# EAGLE design zigduino-v6d (EAGLE 6.3)
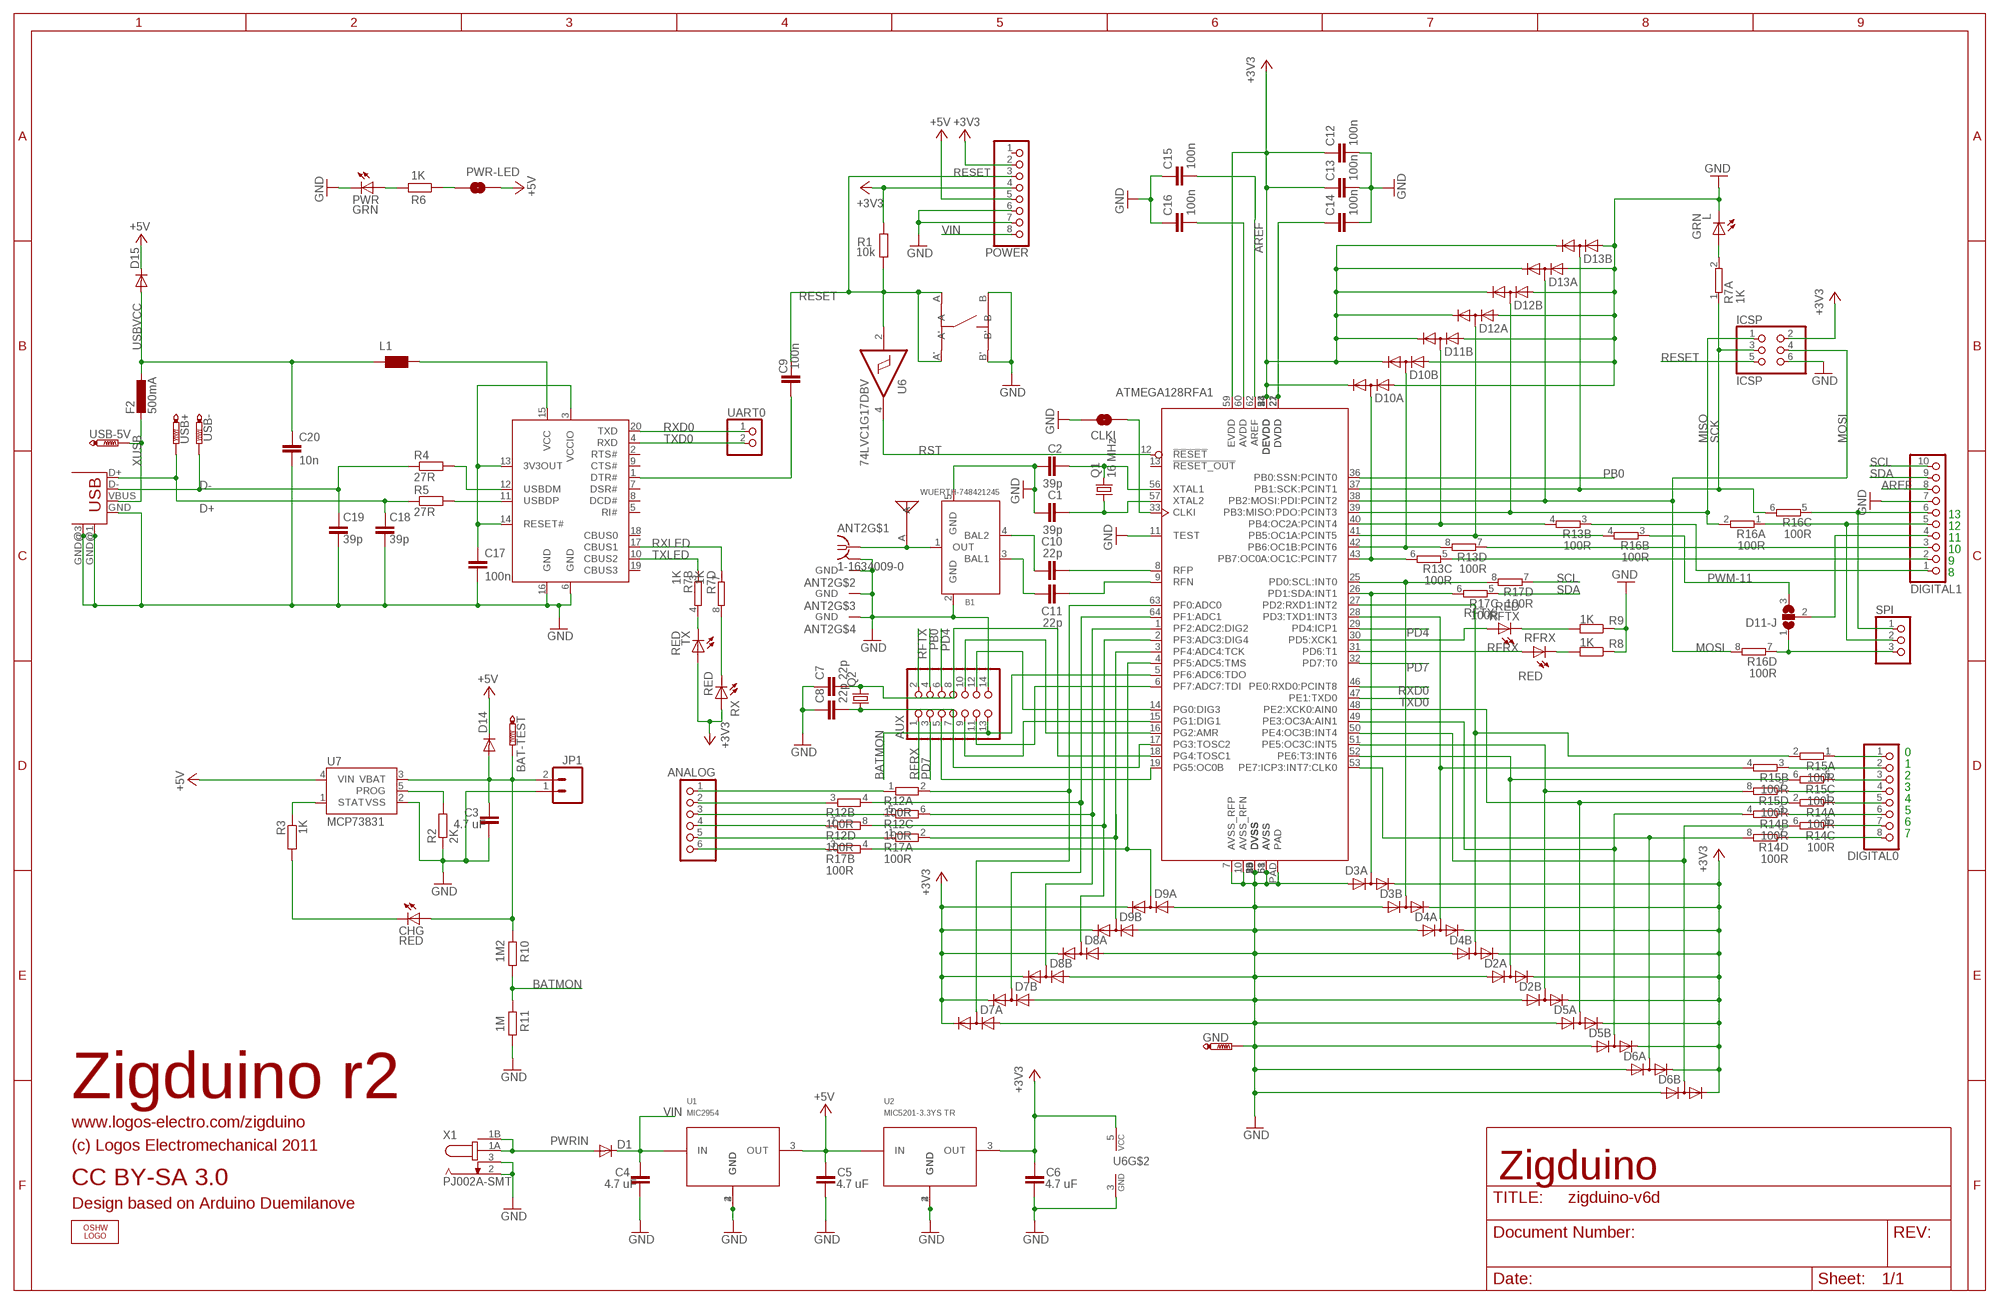
[diagram p0: schematic, sheet 1]

## Parts
ANALOG  PINHD-1X6  [1X06]
ANT1  MOLEX-ANT  [MOLEX-ANT]
ANT2  1-1634009-0  [MMCX-THRU]
AUX  PINHD-2X7_2.00  [2X07M]
B1  WUERTH-748421245  [WURTH-BALUN]
BAT-TEST  PTR1TP13SQ  [TP13SQ]
C1  39p  C-EUC0603  [C0603]
C2  39p  C-EUC0603  [C0603]
C3  4.7 uF  C-EUC1206  [C1206]
C4  4.7 uF  C-EUC1206  [C1206]
C5  4.7 uF  C-EUC1206  [C1206]
C6  4.7 uF  C-EUC1206  [C1206]
C7  22p  C-EUC0603  [C0603]
C8  22p  C-EUC0603  [C0603]
C9  100n  C-EUC0603  [C0603]
C10  22p  C-EUC0603  [C0603]
C11  22p  C-EUC0603  [C0603]
C12  100n  C-EUC0603  [C0603]
C13  100n  C-EUC0603  [C0603]
C14  100n  C-EUC0603  [C0603]
C15  100n  C-EUC0603  [C0603]
C16  100n  C-EUC0603  [C0603]
C17  100n  C-EUC0603  [C0603]
C18  39p  C-EUC0603  [C0603]
C19  39p  C-EUC0603  [C0603]
C20  10n  C-EUC0603  [C0603]
CHG  RED  LEDCHIP-LED0603  [CHIP-LED0603]
CLKI  SOLDERJUMPERTRACE  [SJ_2S-TRACE]
D1  DIODE-SMB  [SMB]
D2  SD103ASDM  [SOT26]
D3  SD103ASDM  [SOT26]
D4  SD103ASDM  [SOT26]
D5  SD103ASDM  [SOT26]
D6  SD103ASDM  [SOT26]
D7  SD103ASDM  [SOT26]
D8  SD103ASDM  [SOT26]
D9  SD103ASDM  [SOT26]
D10  SD103ASDM  [SOT26]
D11  SD103ASDM  [SOT26]
D11-J  SJ2W  [SJ_2]
D12  SD103ASDM  [SOT26]
D13  SD103ASDM  [SOT26]
D14  DIODE-SMB  [SMB]
D15  DIODE-SMB  [SMB]
DIGITAL0  PINHD-1X8  [1X08]
DIGITAL1  PINHD-1X10  [1X10]
F2  500mA  L-EUL1812  [L1812]
GND  PTR1TP13SQ  [TP13SQ]
ICSP  ICSP  PINHD-2X3  [2X03]
JP1  M02-JST-2MM-SMT  [S2B-PH]
L  GRN  LEDCHIP-LED0603  [CHIP-LED0603]
L1  WE-CBF_0805  [0805]
LOGO1  OSHW_LOGO_FILLX0200-NT  [OSHW_FILLX200_NOTEXT]
POWER  PINHD-1X8  [1X08]
PWR  GRN  LEDCHIP-LED0603  [CHIP-LED0603]
PWR-LED  SOLDERJUMPERTRACE  [SJ_2S-TRACE]
Q1  16 MHz  CRYSTALCSM-3X  [CSM-3X]
Q2  CRYSTALTC26H  [TC26H]
R1  10k  R-EU_R0603  [R0603]
R2  2K  R-EU_R0603  [R0603]
R3  1K  R-EU_R0603  [R0603]
R4  27R  R-EU_R0603  [R0603]
R5  27R  R-EU_R0603  [R0603]
R6  1K  R-EU_R0603  [R0603]
R7  1K  4R-NCTS742C083  [CTS742C083-RES]
R8  1K  R-EU_R0603  [R0603]
R9  1K  R-EU_R0603  [R0603]
R10  1M2  R-EU_R0603  [R0603]
R11  1M  R-EU_R0603  [R0603]
R12  100R  4R-NCTS742C083  [CTS742C083-RES]
R13  100R  4R-NCTS742C083  [CTS742C083-RES]
R14  100R  4R-NCTS742C083  [CTS742C083-RES]
R15  100R  4R-NCTS742C083  [CTS742C083-RES]
R16  100R  4R-NCTS742C083  [CTS742C083-RES]
R17  100R  4R-NCTS742C083  [CTS742C083-RES]
RFRX  RED  LEDCHIP-LED0603  [CHIP-LED0603]
RFTX  RED  LEDCHIP-LED0603  [CHIP-LED0603]
RX  RED  LEDCHIP-LED0603  [CHIP-LED0603]
SPI  PINHD-1X3  [1X03]
SW1  EVQ-PSD02K  [EVQPSD02K]
TX  RED  LEDCHIP-LED0603  [CHIP-LED0603]
U1  MIC2954  [SOT223]
U2  MIC5201-3.3YS TR  MIC5201-3.3BS  [SOT223]
U3  ATMEGA128RFA1  [QFN64]
U4  FT231XS-R  [SSOP20]
U6  74LVC1G17DBV  [SOT23-5]
U7  MCP73831  [SOT23-5]
UART0  PINHD-1X2  [1X02]
USB  USB-MB-S  [USB-MB-S]
USB+  PTR1TP13SQ  [TP13SQ]
USB-  PTR1TP13SQ  [TP13SQ]
USB-5V  PTR1TP13SQ  [TP13SQ]
X1  PJ002A-SMT  [PJ002A-SMT]

## Nets
+3V3: C6.1 C12.1 C13.1 D2.2(A:C) D2.5(B:C) D3.2(A:C) D3.5(B:C) D4.2(A:C) D4.5(B:C) D5.2(A:C) D5.5(B:C) D6.2(A:C) D6.5(B:C) D7.2(A:C) D7.5(B:C) D8.2(A:C) D8.5(B:C) D9.2(A:C) D9.5(B:C) D10.2(A:C) D10.5(B:C) D11.5(B:C) D12.2(A:C) D12.5(B:C) D13.2(A:C) D13.5(B:C) ICSP.2 POWER.2 POWER.4 R1.2 RX.A TX.A U2.3(OUT) U3.23(DEVDD) U3.34(DEVDD) U3.44(DEVDD) U3.54(DEVDD) U3.59(EVDD) U6.5(VCC)
+5V [usbvcc]: C5.1 D14.C D15.C POWER.5 PWR-LED.2 U1.3(OUT) U2.1(IN) U7.4(VIN)
AREF [aref]: C15.2 DIGITAL1.8 U3.62(AREF)
BATMON: AUX.13 R10.2 R11.1 U3.5(PF6:ADC6:TDO)
D+: C18.1 R5.1 USB+.TP USB.D+
D-: C19.1 R4.1 USB-.TP USB.D-
DTR: C9.1 U4.1(DTR#)
GND [gnd]: ANT2.G@0(GND) ANT2.G@1(GND) ANT2.G@2(GND) ANT2.G@3(GND) AUX.14 B1.2(GND) B1.5(GND) C1.1 C2.1 C3.2 C4.2 C5.2 C6.2 C7.1 C8.1 C12.2 C13.2 C14.2 C15.1 C16.1 C17.2 C18.2 C19.2 C20.2 CLKI.2 D2.3(A:A) D2.6(B:A) D3.3(A:A) D3.6(B:A) D4.3(A:A) D4.6(B:A) D5.3(A:A) D5.6(B:A) D6.3(A:A) D6.6(B:A) D7.3(A:A) D7.6(B:A) D8.3(A:A) D8.6(B:A) D9.3(A:A) D9.6(B:A) D10.3(A:A) D10.6(B:A) D11.6(B:A) D12.3(A:A) D12.6(B:A) D13.3(A:A) D13.6(B:A) DIGITAL1.7 GND.TP ICSP.6 JP1.1 L.C POWER.6 POWER.7 PWR.C R2.1 R8.1 R9.1 R11.2 SW1.B SW1.B' U1.2(GND) U1.4(GND) U2.2(GND) U2.4(GND) U3.7(AVSS_RFP) U3.10(AVSS_RFN) U3.11(TEST) U3.20(DVSS) U3.24(DVSS) U3.35(DVSS) U3.45(DVSS) U3.55(DVSS) U3.58(AVSS) U3.61(AVSS) U3.PAD U4.6(GND) U4.16(GND) U6.3(GND) U7.2(VSS) USB.GND USB.GND@1(GND) USB.GND@3(GND) X1.2 X1.3
MISO: D12.1(B:AC) ICSP.1 R16.2 U3.39(PB3:MISO:PDO:PCINT3)
MOSI: D13.4(A:AC) ICSP.4 R16.8 U3.38(PB2:MOSI:PDI:PCINT2)
MOSI-PIN: D11-J.1 R16.7 SPI.3
N$1: R9.2 RFTX.C
N$2: L.A R7.2
N$3: PWR.A R6.2
N$4 [rf]: B1.4(BAL2) C10.1
N$5: DIGITAL0.3 R15.5
N$6: C1.2 Q1.1 U3.57(XTAL2)
N$7: C2.2 Q1.2 U3.56(XTAL1)
N$8: PWR-LED.1 R6.1
N$9 [rf]: B1.3(BAL1) C11.1
N$10: DIGITAL1.5 R16.1 SPI.2
N$11: DIGITAL0.5 R14.1
N$12: DIGITAL0.7 R14.5
N$13: DIGITAL0.6 R14.3
N$14: DIGITAL0.4 R15.7
N$15: DIGITAL0.8 R14.7
N$16: D3.1(B:AC) R17.8 U3.25(PD0:SCL:INT0)
N$17: D3.4(A:AC) R17.6 U3.26(PD1:SDA:INT1)
N$18 [gnd]: ANT1.A ANT2.C B1.1(OUT)
N$19: D12.4(A:AC) R16.4 U3.41(PB5:OC1A:PCINT5)
N$20: R8.2 RFRX.C
N$21: D2.4(A:AC) R15.6 U3.52(PE6:T3:INT6)
N$22: D2.1(B:AC) R15.8 U3.51(PE5:OC3C:INT5)
N$23 [rf]: C10.2 U3.8(RFP)
N$24 [rf]: C11.2 U3.9(RFN)
N$25: DIGITAL1.6 R16.5 SPI.1
N$26: R2.2 U7.5(PROG)
N$27: R3.1 U7.1(STAT)
N$28: R7.4 TX.C
N$29: CHG.C R3.2
N$30: C17.1 U4.3(VCCIO) U4.13(3V3OUT) U4.14(RESET#)
N$31: R7.8 RX.C
N$33: D11.1(B:AC) R13.4 U3.40(PB4:OC2A:PCINT4)
N$34 [gnd]: CLKI.1 U3.33(CLKI)
N$35: R4.2 U4.12(USBDM)
N$36: R5.2 U4.11(USBDP)
N$37: L1.2 U4.15(VCC)
N$38: D10.1(B:AC) R13.8 U3.42(PB6:OC1B:PCINT6)
N$39: D10.4(A:AC) R13.6 U3.43(PB7:OC0A:OC1C:PCINT7)
N$40: D5.4(A:AC) R14.2 U3.48(PE2:XCK0:AIN0)
N$41: D6.1(B:AC) R14.6 U3.50(PE4:OC3B:INT4)
N$42: D5.1(B:AC) R14.4 U3.49(PE3:OC3A:AIN1)
N$43: D6.4(A:AC) R14.8 U3.53(PE7:ICP3:INT7:CLK0)
N$44: ANALOG.5 R17.1
N$45: ANALOG.6 R17.3
N$47: AUX.11 U3.6(PF7:ADC7:TDI)
N$48: D7.4(A:AC) R12.2 U3.63(PF0:ADC0)
N$49: D7.1(B:AC) R12.4 U3.64(PF1:ADC1)
N$50: D8.1(B:AC) R12.6 U3.1(PF2:ADC2:DIG2)
N$51: D8.4(A:AC) R12.8 U3.2(PF3:ADC3:DIG4)
N$52: D9.1(B:AC) R17.2 U3.3(PF4:ADC4:TCK)
N$53: D9.4(A:AC) R17.4 U3.4(PF5:ADC5:TMS)
N$54: ANALOG.1 R12.1
N$55: ANALOG.2 R12.3
N$56: ANALOG.3 R12.5
N$57: ANALOG.4 R12.7
N$60: DIGITAL1.1 R13.3
N$61: D11-J.2 DIGITAL1.4
N$62: AUX.12 U3.14(PG0:DIG3)
N$63: C14.1 U3.21(DVDD) U3.22(DVDD)
N$64: C16.2 U3.60(AVDD)
N$65: DIGITAL1.2 R13.5
N$68: DIGITAL0.1 R15.1
N$69: DIGITAL0.2 R15.3
N$70: AUX.9 U3.15(PG1:DIG1)
N$71: AUX.5 U3.19(PG5:OC0B)
N$72: AUX.8 C7.2 Q2.2 U3.18(PG4:TOSC1)
N$73: AUX.7 C8.2 Q2.1 U3.17(PG3:TOSC2)
N$74: AUX.10 U3.16(PG2:AMR)
PB0: AUX.4 U3.36(PB0:SSN:PCINT0)
PD4: AUX.6 U3.29(PD4:ICP1)
PD7: AUX.3 U3.32(PD7:T0)
PWM-10: DIGITAL1.3 R13.7
PWM-11: D11-J.3 R16.3
PWRIN [power]: D1.A X1.1A X1.1B
RESET: C9.2 ICSP.5 POWER.3 R1.1 SW1.A SW1.A' U6.2(I)
RFRX: AUX.1 RFRX.A U3.31(PD6:T1)
RFTX: AUX.2 RFTX.A U3.30(PD5:XCK1)
RST: U3.12(!RESET!) U6.4(O)
RXD0: U3.46(PE0:RXD0:PCINT8) U4.20(TXD) UART0.1
RXD1: D4.1(B:AC) R15.2 U3.27(PD2:RXD1:INT2)
RXLED: R7.7 U4.17(CBUS1)
SCK: D13.1(B:AC) ICSP.3 R7.1 R16.6 U3.37(PB1:SCK:PCINT1)
SCL: DIGITAL1.10 R17.7
SDA: DIGITAL1.9 R17.5
TXD0: U3.47(PE1:TXD0) U4.4(RXD) UART0.2
TXD1: D4.4(A:AC) R15.4 U3.28(PD3:TXD1:INT3)
TXLED: R7.3 U4.10(CBUS2)
USBVCC [usbvcc]: C20.1 D15.A F2.1 L1.1
VBAT: BAT-TEST.TP C3.1 CHG.A D14.A JP1.2 R10.1 U7.3(VBAT)
VIN [power]: C4.1 D1.C POWER.8 U1.1(IN)
XUSB: F2.2 USB-5V.TP USB.VBUS
Unconnected: D11.2(A:C) D11.3(A:A) D11.4(A:AC) POWER.1 R7.5 R7.6 R13.1 R13.2 U3.13(!RESET_OUT!) U4.2(RTS#) U4.5(RI#) U4.7(DSR#) U4.8(DCD#) U4.9(CTS#) U4.18(CBUS0) U4.19(CBUS3)

## Notes on the sheet
- ATMEGA128RFA1
- 13
- 12
- 11
- 10
- 9
- 8
- 0
- 1
- 2
- 3
- 4
- 5
- 6
- 7
- Zigduino r2
- www.logos-electro.com/zigduino
- (c) Logos Electromechanical 2011
- CC BY-SA 3.0 | Zigduino
- Design based on Arduino Duemilanove

## Library data of the parts
ANALOG = pinhead:PINHD-1X6: PIN HEADER; BOM: INCLUDE; DNP: T; PARTNO: 19742
ANT1 = atmega128rfa1:MOLEX-ANT; BOM: INCLUDE; PARTNO: 0479480001
ANT2 = atmega128rfa1:1-1634009-0: Thru-hole MMCX connector TE Connectivity; BOM: EXCLUDE; DNP: T
AUX = pinhead-1:PINHD-2X7: PIN HEADER; DNP: T; PARTNO: 00217
B1 = atmega128rfa1:WUERTH-748421245: Recommended Balun for Atmega128RFA1; BOM: INCLUDE; PARTNO: 748421245
BAT-TEST GND USB+ USB- USB-5V = testpad:PTR1: TEST PIN; BOM: EXCLUDE; DNP: T; PARTNO: TP13
C1 C2 C18 C19 = resistor:C-EU: CAPACITOR, European symbol; PARTNO: C1608C0G1H390J
C3-C6 = resistor:C-EU: CAPACITOR, European symbol; PARTNO: C3216Y5V1H475Z; VOLT: 50V
C7 C8 = resistor:C-EU: CAPACITOR, European symbol; BOM: EXCLUDE; DNP: T; PARTNO: GQM1885C1H220JB01D
C9 C12-C17 = resistor:C-EU: CAPACITOR, European symbol; PARTNO: CC0603MRY5V9BB104
C10 C11 = resistor:C-EU: CAPACITOR, European symbol; PARTNO: GQM1885C1H220JB01D
C20 = resistor:C-EU: CAPACITOR, European symbol; PARTNO: GRM188R71H103KA01D
CHG = led:LED: LED OSRAM: - CHIPLED LG R971, LG N971, LY N971, LG Q971, LY Q971, LO R971, LY R971 LH N974, LH R974 LS Q976, LO Q976, LY Q976 LO Q996 - Hyper CHIPLED LW Q18S LB Q993, LB Q99A, LB R99A - SideLED LS A670, LO A670, LY A670, LG A670, LP A670 LB A673, LV A673, LT A673, LW A673 LH A674 LY A675 LS A676, LA A676, LO A676, LY A676, LW A676 LS A679, LY A679, LG A679 - Hyper Micro SIDELED® LS Y876, LA Y876, LO Y876, LY Y876 LT Y87S - SmartLED LW L88C, LW L88S LB L89C, LB L89S, LG L890 LS L89K, LO L89K, LY L89K LS L896, LA L896, LO L896, LY L896 - TOPLED LS T670, LO T670, LY T670, LG T670, LP T670 LSG T670, LSP T670, LSY T670, LOP T670, LYG T670 LG T671, LOG T671, LSG T671 LB T673, LV T673, LT T673, LW T673 LH T674 LS T676, LA T676, LO T676, LY T676, LB T676, LH T676, LSB T676, LW T676 LB T67C, LV T67C, LT T67C, LS T67K, LO T67K, LY T67K, LW E67C LS E67B, LA E67B, LO E67B, LY E67B, LB E67C, LV E67C, LT E67C LW T67C LS T679, LY T679, LG T679 LS T770, LO T770, LY T770, LG T770, LP T770 LB T773, LV T773, LT T773, LW T773 LH T774 LS E675, LA E675, LY E675, LS T675 LS T776, LA T776, LO T776, LY T776, LB T776 LHGB T686 LT T68C, LB T68C - Hyper Mini TOPLED® LB M676 - Mini TOPLED Santana® LG M470 LS M47K, LO M47K, LY M47K Source: http://www.osram.convergy.de LUXEON: - LUMILED® LXK2-PW12-R00, LXK2-PW12-S00, LXK2-PW14-U00, LXK2-PW14-V00 LXK2-PM12-R00, LXK2-PM12-S00, LXK2-PM14-U00 LXK2-PE12-Q00, LXK2-PE12-R00, LXK2-PE12-S00, LXK2-PE14-T00, LXK2-PE14-U00 LXK2-PB12-K00, LXK2-PB12-L00, LXK2-PB12-M00, LXK2-PB14-N00, LXK2-PB14-P00, LXK2-PB14-Q00 LXK2-PR12-L00, LXK2-PR12-M00, LXK2-PR14-Q00, LXK2-PR14-R00 LXK2-PD12-Q00, LXK2-PD12-R00, LXK2-PD12-S00 LXK2-PH12-R00, LXK2-PH12-S00 LXK2-PL12-P00, LXK2-PL12-Q00, LXK2-PL12-R00 Source: www.luxeon.com KINGBRIGHT: KA-3528ASYC Source: www.kingbright.com; PARTNO: LTST-C193KRKT-5A
CLKI PWR-LED = SparkFun:SOLDERJUMPER: Solder Jumper Standard SMD solder jumper. Used to automate production. Two varients : Normally Open and Normally Closed are the same, but have different paste layers. NC will have a large amount of paste and should jumper during reflow.; BOM: EXCLUDE
D1 D14 D15 = diode:DIODE-: DIODE; PARTNO: B150B-13-F
D2-D13 = logos-diodes:SD103ASDM: Digikey SD103ASDM-FDICT-ND; BOM: INCLUDE; PARTNO: SD103ASDM-7; VOLT: 40V
D11-J = jumper:SJ2W: SMD solder JUMPER; BOM: EXCLUDE; DNP: T; PARTNO: SJ3
DIGITAL0 POWER = pinhead:PINHD-1X8: PIN HEADER; BOM: INCLUDE; DNP: T; PARTNO: 19743
DIGITAL1 = pinhead:PINHD-1X10: PIN HEADER; DNP: T; PARTNO: 20083
F2 = rcl:L-EU: INDUCTOR, European symbol; PARTNO: MF-MSMF050-2
ICSP = pinhead:PINHD-2X3: PIN HEADER; BOM: INCLUDE; DNP: T; PARTNO: 961206-6404-AR
JP1 = SparkFun:M02: Header 2 Standard 2-pin 0.1" header. Use with straight break away headers (SKU : PRT-00116), right angle break away headers (PRT-00553), swiss pins (PRT-00743), machine pins (PRT-00117), and female headers (PRT-00115). Molex polarized connector foot print use with SKU : PRT-08233 with associated crimp pins and housings.; PARTNO: S2B-PH-SM4-TB(LF)(SN)
L PWR = led:LED: LED OSRAM: - CHIPLED LG R971, LG N971, LY N971, LG Q971, LY Q971, LO R971, LY R971 LH N974, LH R974 LS Q976, LO Q976, LY Q976 LO Q996 - Hyper CHIPLED LW Q18S LB Q993, LB Q99A, LB R99A - SideLED LS A670, LO A670, LY A670, LG A670, LP A670 LB A673, LV A673, LT A673, LW A673 LH A674 LY A675 LS A676, LA A676, LO A676, LY A676, LW A676 LS A679, LY A679, LG A679 - Hyper Micro SIDELED® LS Y876, LA Y876, LO Y876, LY Y876 LT Y87S - SmartLED LW L88C, LW L88S LB L89C, LB L89S, LG L890 LS L89K, LO L89K, LY L89K LS L896, LA L896, LO L896, LY L896 - TOPLED LS T670, LO T670, LY T670, LG T670, LP T670 LSG T670, LSP T670, LSY T670, LOP T670, LYG T670 LG T671, LOG T671, LSG T671 LB T673, LV T673, LT T673, LW T673 LH T674 LS T676, LA T676, LO T676, LY T676, LB T676, LH T676, LSB T676, LW T676 LB T67C, LV T67C, LT T67C, LS T67K, LO T67K, LY T67K, LW E67C LS E67B, LA E67B, LO E67B, LY E67B, LB E67C, LV E67C, LT E67C LW T67C LS T679, LY T679, LG T679 LS T770, LO T770, LY T770, LG T770, LP T770 LB T773, LV T773, LT T773, LW T773 LH T774 LS E675, LA E675, LY E675, LS T675 LS T776, LA T776, LO T776, LY T776, LB T776 LHGB T686 LT T68C, LB T68C - Hyper Mini TOPLED® LB M676 - Mini TOPLED Santana® LG M470 LS M47K, LO M47K, LY M47K Source: http://www.osram.convergy.de LUXEON: - LUMILED® LXK2-PW12-R00, LXK2-PW12-S00, LXK2-PW14-U00, LXK2-PW14-V00 LXK2-PM12-R00, LXK2-PM12-S00, LXK2-PM14-U00 LXK2-PE12-Q00, LXK2-PE12-R00, LXK2-PE12-S00, LXK2-PE14-T00, LXK2-PE14-U00 LXK2-PB12-K00, LXK2-PB12-L00, LXK2-PB12-M00, LXK2-PB14-N00, LXK2-PB14-P00, LXK2-PB14-Q00 LXK2-PR12-L00, LXK2-PR12-M00, LXK2-PR14-Q00, LXK2-PR14-R00 LXK2-PD12-Q00, LXK2-PD12-R00, LXK2-PD12-S00 LXK2-PH12-R00, LXK2-PH12-S00 LXK2-PL12-P00, LXK2-PL12-Q00, LXK2-PL12-R00 Source: www.luxeon.com KINGBRIGHT: KA-3528ASYC Source: www.kingbright.com; COLOR: RED; PARTNO: LTST-C193KGKT-5A
L1 = wuerth-elektronik:WE-CBF: SMD EMI Suppression Ferrite Beads - excellent anti-EMI properties - low DCR - impedances till 3000 ohms - rated current up to 6 A; PARTNO: MI0805K400R-10
LOGO1 = OSHW:OSHW_LOGO_FILL; BOM: EXCLUDE; DNP: T
Q1 = logos-crystals:CRYSTAL: CRYSTAL; PARTNO: ECS-160-20-3X-TR
Q2 = crystal:CRYSTAL: CRYSTAL; BOM: EXCLUDE; DNP: T; OC_FARNELL: unknown; OC_NEWARK: unknown
R1 = resistor:R-EU_: RESISTOR, European symbol; PARTNO: RMCF0603FT10K0
R2 = resistor:R-EU_: RESISTOR, European symbol; PARTNO: RC0603FR-072KL
R3 R8 R9 = resistor:R-EU_: RESISTOR, European symbol; PARTNO: RMCF0603FT1K00
R4 R5 = resistor:R-EU_: RESISTOR, European symbol; PARTNO: RC0603JR-0727RL
R6 = resistor:R-EU_: RESISTOR, European symbol; BOM: INCLUDE; PARTNO: RMCF0603FT1K00
R7 = res-cap-arrays:4R-N: Array Chip Resistor Source: RS Component / Phycomp; BOM: INCLUDE; PARTNO: 742C083102JPTR
R10 = resistor:R-EU_: RESISTOR, European symbol; BOM: INCLUDE; PARTNO: ERJ-3EKF1204V
R11 = resistor:R-EU_: RESISTOR, European symbol; BOM: INCLUDE; PARTNO: ERJ-3EKF1004V
R12-R17 = res-cap-arrays:4R-N: Array Chip Resistor Source: RS Component / Phycomp; BOM: INCLUDE; PARTNO: 742C083101JPTR
RFRX RFTX RX TX = led:LED: LED OSRAM: - CHIPLED LG R971, LG N971, LY N971, LG Q971, LY Q971, LO R971, LY R971 LH N974, LH R974 LS Q976, LO Q976, LY Q976 LO Q996 - Hyper CHIPLED LW Q18S LB Q993, LB Q99A, LB R99A - SideLED LS A670, LO A670, LY A670, LG A670, LP A670 LB A673, LV A673, LT A673, LW A673 LH A674 LY A675 LS A676, LA A676, LO A676, LY A676, LW A676 LS A679, LY A679, LG A679 - Hyper Micro SIDELED® LS Y876, LA Y876, LO Y876, LY Y876 LT Y87S - SmartLED LW L88C, LW L88S LB L89C, LB L89S, LG L890 LS L89K, LO L89K, LY L89K LS L896, LA L896, LO L896, LY L896 - TOPLED LS T670, LO T670, LY T670, LG T670, LP T670 LSG T670, LSP T670, LSY T670, LOP T670, LYG T670 LG T671, LOG T671, LSG T671 LB T673, LV T673, LT T673, LW T673 LH T674 LS T676, LA T676, LO T676, LY T676, LB T676, LH T676, LSB T676, LW T676 LB T67C, LV T67C, LT T67C, LS T67K, LO T67K, LY T67K, LW E67C LS E67B, LA E67B, LO E67B, LY E67B, LB E67C, LV E67C, LT E67C LW T67C LS T679, LY T679, LG T679 LS T770, LO T770, LY T770, LG T770, LP T770 LB T773, LV T773, LT T773, LW T773 LH T774 LS E675, LA E675, LY E675, LS T675 LS T776, LA T776, LO T776, LY T776, LB T776 LHGB T686 LT T68C, LB T68C - Hyper Mini TOPLED® LB M676 - Mini TOPLED Santana® LG M470 LS M47K, LO M47K, LY M47K Source: http://www.osram.convergy.de LUXEON: - LUMILED® LXK2-PW12-R00, LXK2-PW12-S00, LXK2-PW14-U00, LXK2-PW14-V00 LXK2-PM12-R00, LXK2-PM12-S00, LXK2-PM14-U00 LXK2-PE12-Q00, LXK2-PE12-R00, LXK2-PE12-S00, LXK2-PE14-T00, LXK2-PE14-U00 LXK2-PB12-K00, LXK2-PB12-L00, LXK2-PB12-M00, LXK2-PB14-N00, LXK2-PB14-P00, LXK2-PB14-Q00 LXK2-PR12-L00, LXK2-PR12-M00, LXK2-PR14-Q00, LXK2-PR14-R00 LXK2-PD12-Q00, LXK2-PD12-R00, LXK2-PD12-S00 LXK2-PH12-R00, LXK2-PH12-S00 LXK2-PL12-P00, LXK2-PL12-Q00, LXK2-PL12-R00 Source: www.luxeon.com KINGBRIGHT: KA-3528ASYC Source: www.kingbright.com; COLOR: RED; PARTNO: LTST-C193KRKT-5A
SPI = pinhead:PINHD-1X3: PIN HEADER; BOM: INCLUDE; DNP: T; PARTNO: 20152
SW1 = logos-switch:EVQ-PSD02K; PARTNO: EVQ-PSD02K
U1 = logos-faves:MIC2954: 5V 250mA regulator; BOM: INCLUDE; PARTNO: MIC2954-03WS-TR
U2 = logos-faves:MIC5201: 200 mA 3.3V LDO linear regulator; BOM: INCLUDE; PARTNO: MIC5201-3.3YS TR
U3 = atmega128rfa1:ATMEGA128RFA1: Atmega128RFA1 -- Atmega128 with Zigbee; BOM: INCLUDE; PARTNO: ATMEGA128RFA1-ZUR
U4 = logos-ftdi:FT231X: FTDI FT231X USB UART; PARTNO: FT231XS-R
U6 = 74xx-little-us:74*1G17: Single Schmitt-Trigger Buffer; BOM: INCLUDE; PARTNO: SN74LVC1G17DBVR
U7 = SparkFun:MCP73831: Microchip's MCP73831 Miniature single cell, fully integrated Li-Ion, Li-polymer charge management controller http://ww1.microchip.com/downloads/en/DeviceDoc/21984a.pdf; PARTNO: MCP73831T-2ACI/OT
UART0 = pinhead:PINHD-1X2: PIN HEADER; BOM: INCLUDE; DNP: T; PARTNO: 00522
USB = con-usb-2:USB: USB Connectors; PARTNO: 20236
X1 = logos-headers:PJ002A; PARTNO: PJ-002AH-SMT

## Net classes
0 default: width 0.127 mm, drill 0.33 mm, clearance 0.127 mm
1 power: width 0.152 mm
2 gnd: width 0.152 mm
3 usbvcc: width 0.152 mm
4 aref: width 0.152 mm
5 rf: width 0.152 mm

## Board
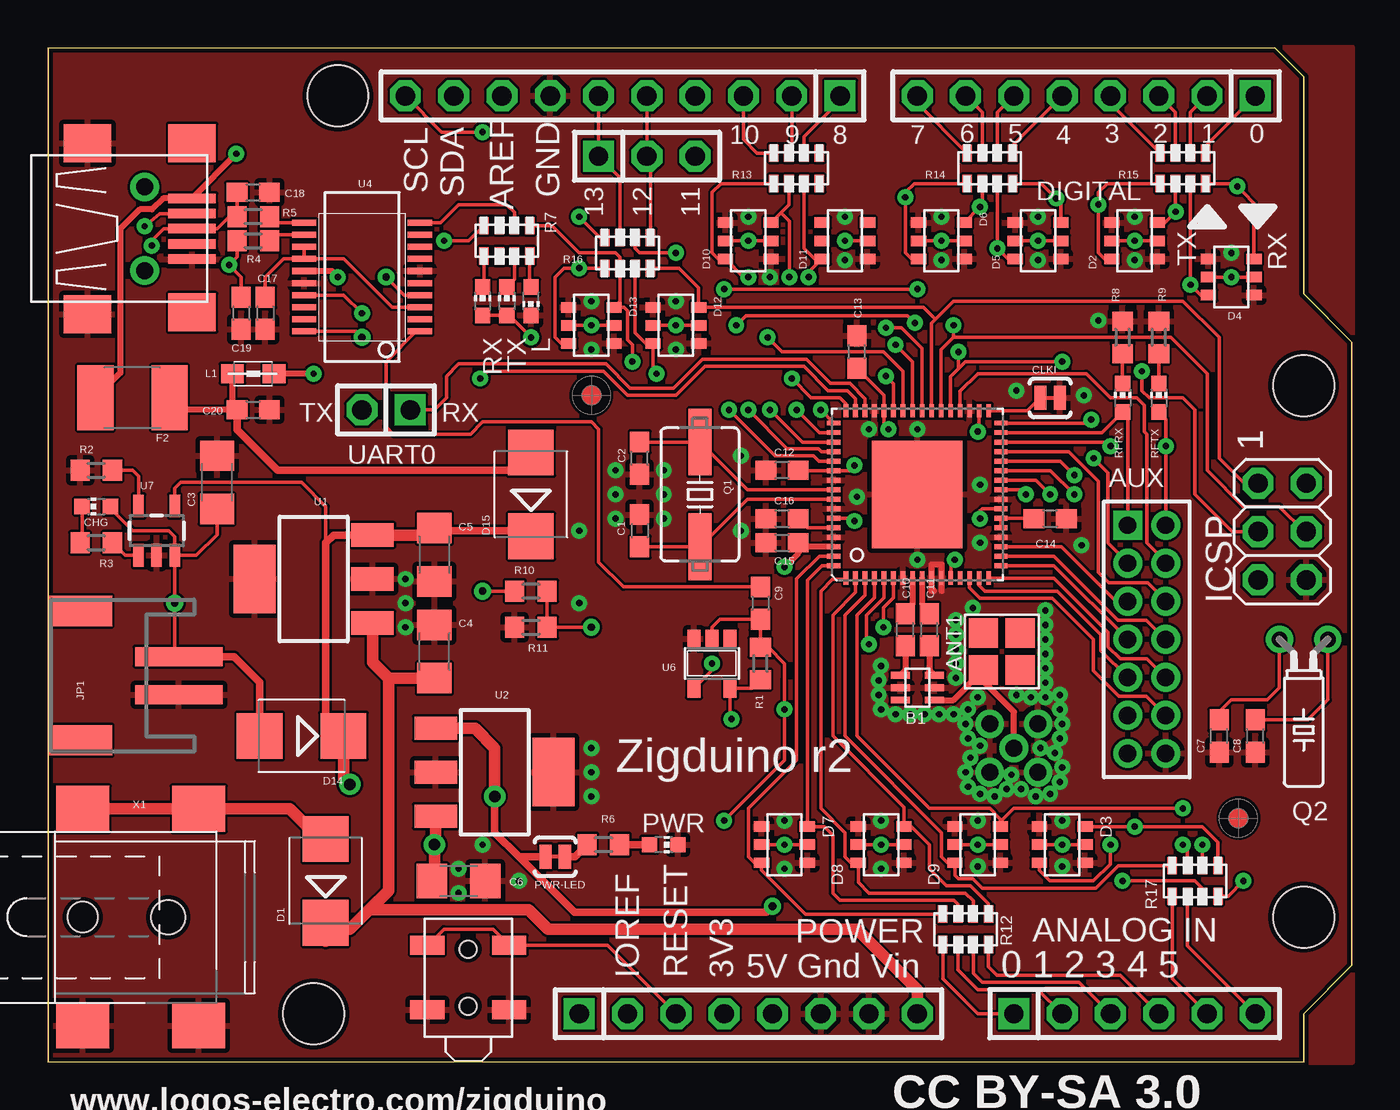
[diagram p1: board, top side]
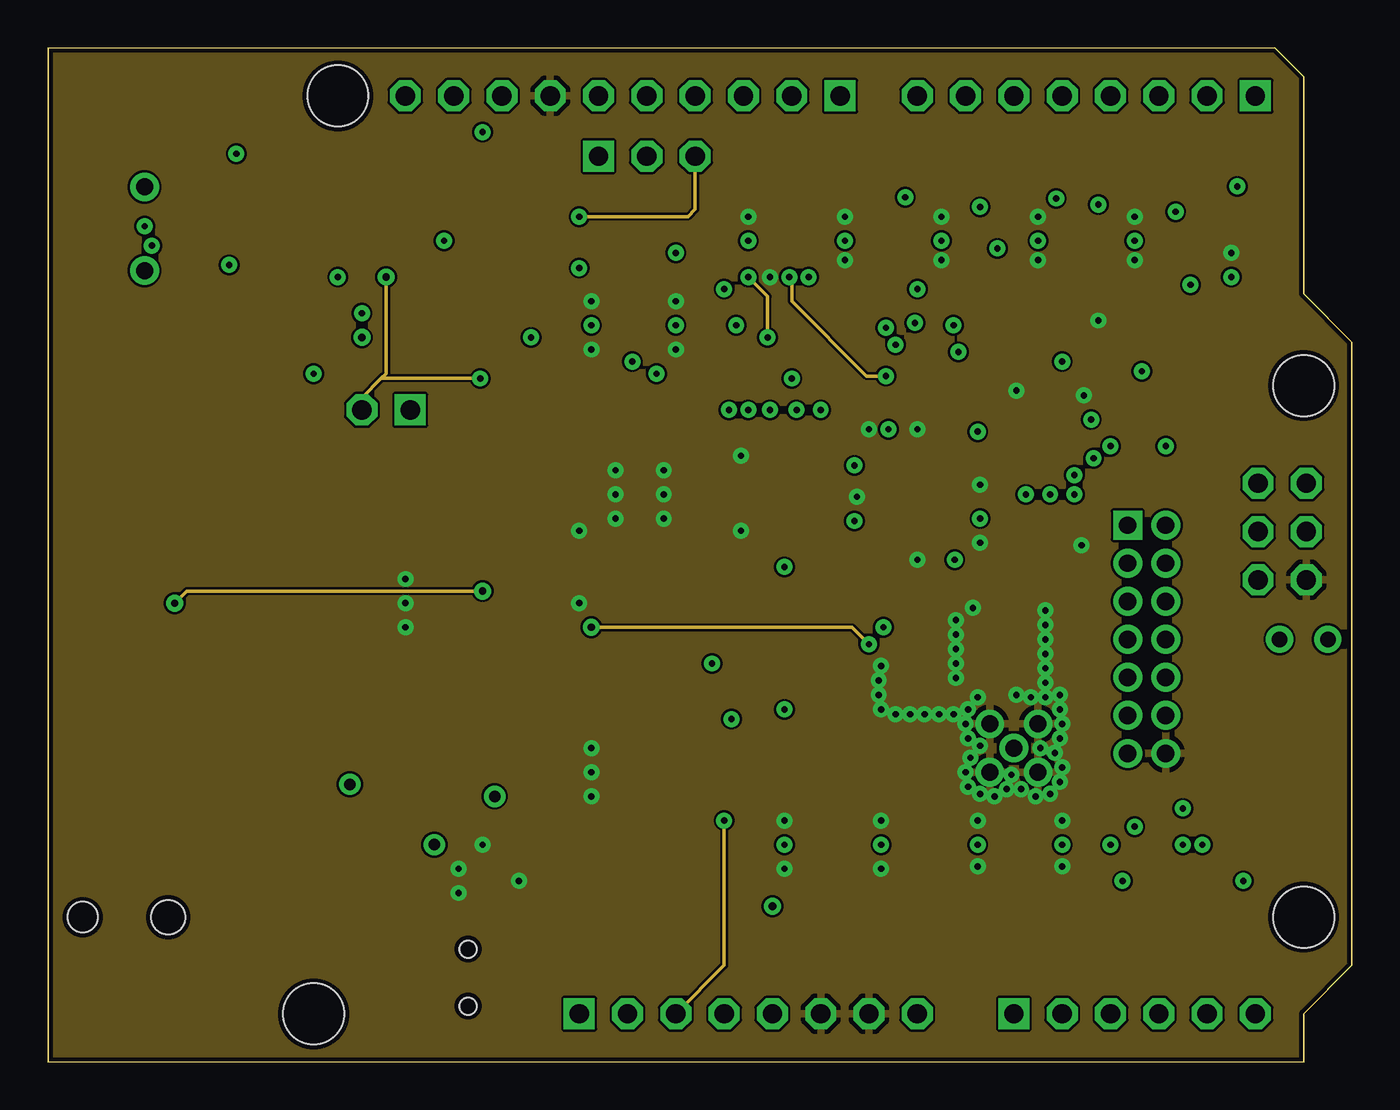
[diagram p2: board, inner layer Route2]
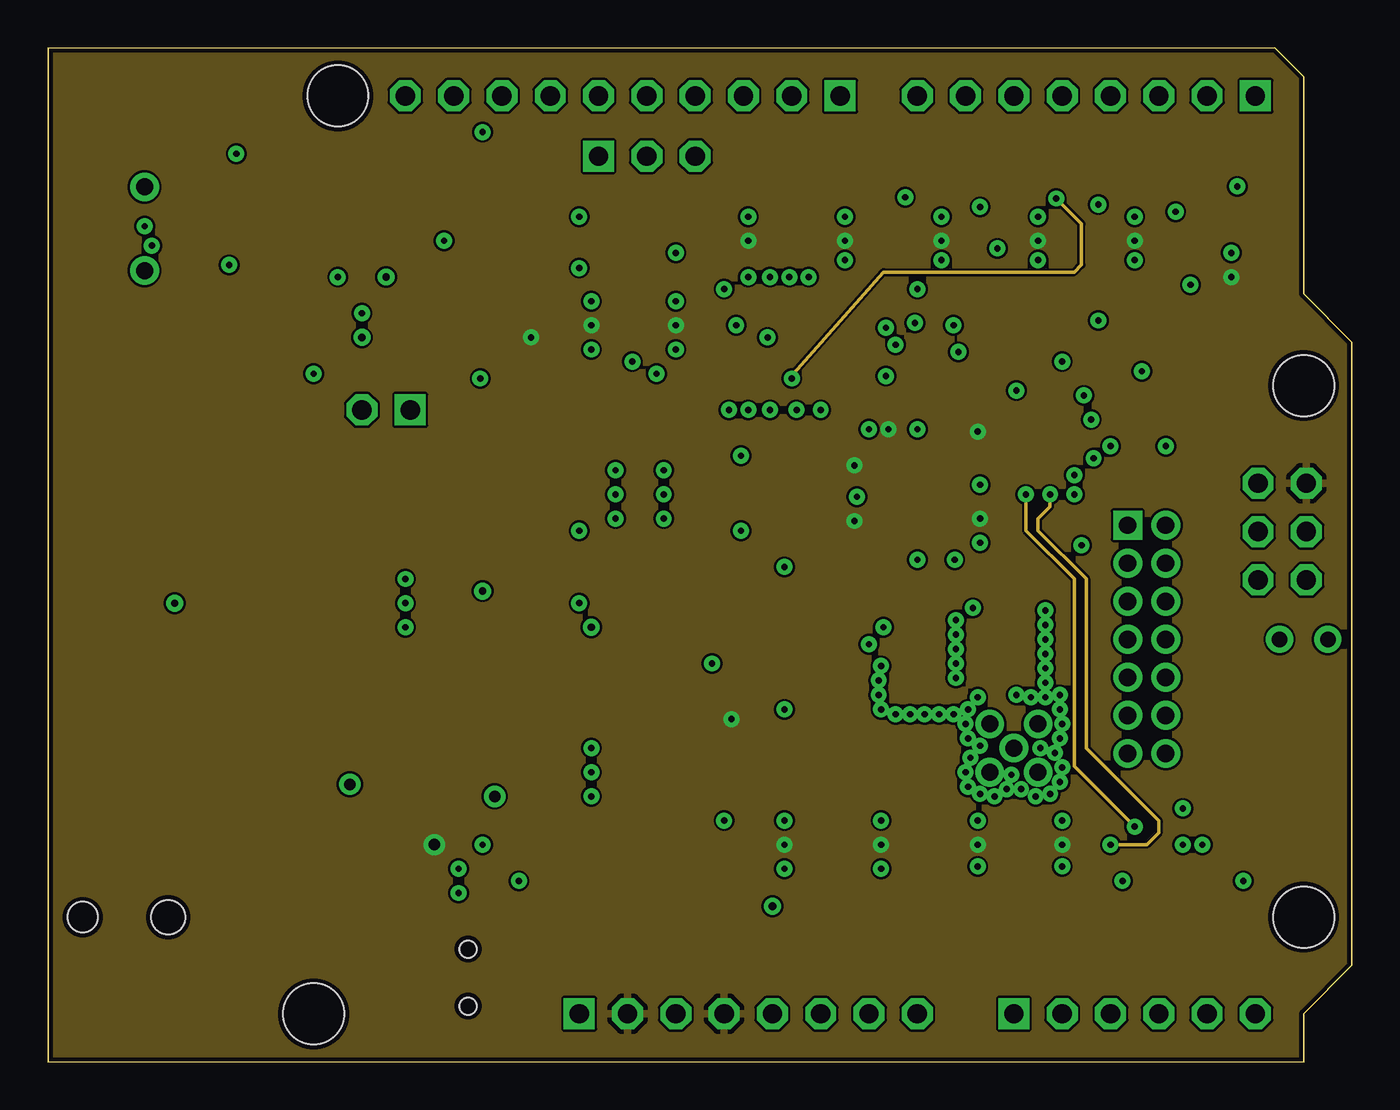
[diagram p3: board, inner layer Route15]
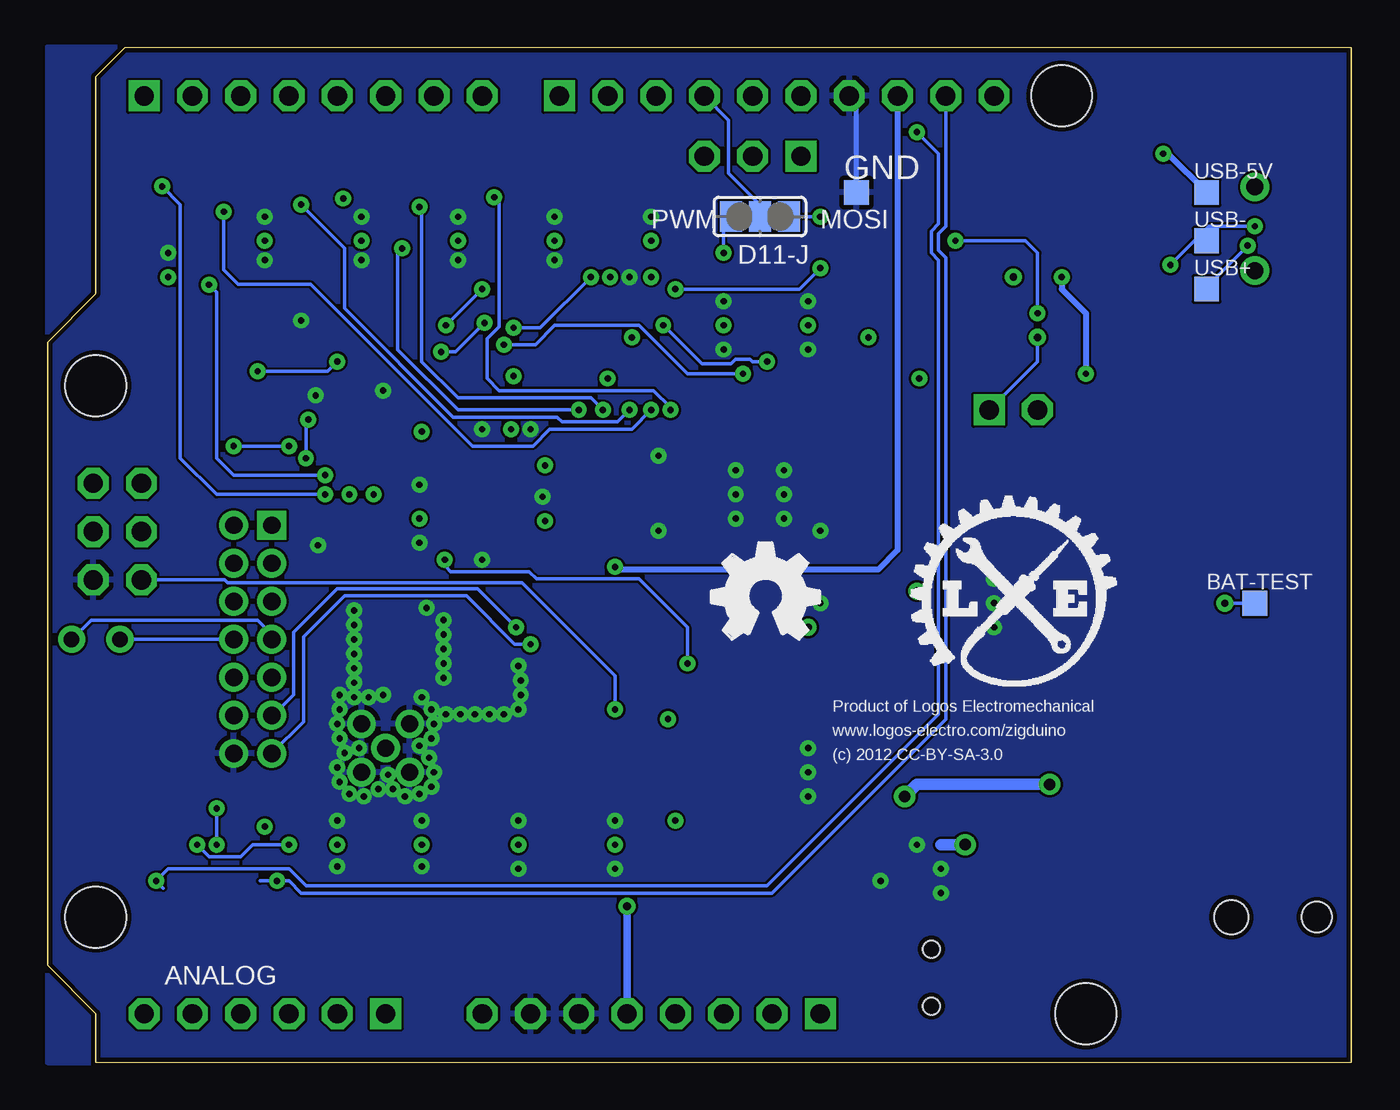
[diagram p4: board, bottom side, seen from below]

Size 68.58 x 53.34 mm. Coordinates in mm from the lower left corner, seen from the top.
Outline: 0,53.34 64.52,53.34 66.04,51.82 66.04,40.39 68.58,37.85 68.58,5.08 66.04,2.54 66.04,0 0,0 0,53.34
Copper layers (1*2*15*16): Top 0.0356mm / dielectric 1.5011mm / Route2 0.0356mm / dielectric 0.1499mm / Route15 0.0356mm / dielectric 0.2007mm / Bottom 0.0356mm
Design rules "default": minimum track width 5mil, minimum drill 12mil, track to track 5mil, track to pad 5mil, pad to pad 5mil, via to via 5mil, smd to smd 0mil, copper to edge 10mil, drill to drill 8mil, minimum pad ring 12mil, minimum via ring 10mil, stop-mask expansion 0mil, vias tented up to drill 50mil, thermal gap 10mil
Holes 3.2 mm at 66.04,35.56 66.04,7.62 15.24,50.8 13.97,2.54
tRestrict: area 27.4,33.9 to 29.7,36.2; area 61.5,11.7 to 63.8,14
Milling: 7 lines

### Footprints (pad centres in the part's own frame; a part is rotated, then mirrored left to right if it is on the bottom)
1X06 = drill 1.016 square: 1 -6.35,0 | drill 1.016 octagon: 2 -3.81,0; 3 -1.27,0; 4 1.27,0; 5 3.81,0; 6 6.35,0
MOLEX-ANT = smd 1.54 x 1.54: A -0.97,0.97; D@0 0.97,0.97; D@1 0.97,-0.97; D@2 -0.97,-0.97
MMCX-THRU = drill 0.9: C 0,0; G@0 -1.27,1.27; G@1 1.27,1.27; G@2 1.27,-1.27; G@3 -1.27,-1.27
2X07M = drill 0.914 square: 1 -6,-1 | drill 0.914: 2 -6,1; 3 -4,-1; 4 -4,1; 5 -2,-1; 6 -2,1; 7 0,-1; 8 0,1; 9 2,-1; 10 2,1; 11 4,-1; 12 4,1; 13 6,-1; 14 6,1
WURTH-BALUN = smd 0.35 x 1: 1 0.65,0.9; 2 0,0.9; 3 -0.65,0.9; 4 -0.65,-0.9; 5 0,-0.9; 6 0.65,-0.9
TP13SQ = smd 1.3 x 1.3: TP 0,0
C0603 = smd 1.1 x 1: 1 -0.85,0; 2 0.85,0
C1206 = smd 1.6 x 1.8: 1 -1.4,0; 2 1.4,0
CHIP-LED0603 = smd 0.8 x 0.8: A 0,-0.75; C 0,0.75
SJ_2S-TRACE = smd 0.635 x 1.27: 1 -0.508,0; 2 0.508,0
SMB = smd 2.4 x 2.4: A 2.2,0; C -2.2,0
SOT26 = smd 0.55 x 0.8: 1 -0.95,1.2; 2 0,1.2; 3 0.95,1.2; 4 0.95,-1.2; 5 0,-1.2; 6 -0.95,-1.2
SJ_2 = smd 1.168 x 1.6: 1 -1.524,0; 2 0,0; 3 1.524,0
1X08 = drill 1.016 square: 1 -8.89,0 | drill 1.016 octagon: 2 -6.35,0; 3 -3.81,0; 4 -1.27,0; 5 1.27,0; 6 3.81,0; 7 6.35,0; 8 8.89,0
1X10 = drill 1.016 square: 1 -11.43,0 | drill 1.016 octagon: 2 -8.89,0; 3 -6.35,0; 4 -3.81,0; 5 -1.27,0; 6 1.27,0; 7 3.81,0; 8 6.35,0; 9 8.89,0; 10 11.43,0
L1812 = smd 1.9 x 3.4: 1 -1.95,0; 2 1.95,0
2X03 = drill 1.016 octagon: 1 -2.54,-1.27; 2 -2.54,1.27; 3 0,-1.27; 4 0,1.27; 5 2.54,-1.27; 6 2.54,1.27
S2B-PH = smd 1 x 4.6: 1 -1,-3.7; 2 1,-3.7 | smd 1.6 x 3.4: NC1 -3.4,1.5; NC2 3.4,1.5
0805 = smd 1.2 x 1: 1 -1.1,0; 2 1.1,0
CSM-3X = smd 3.5 x 1.2: 1 -2.75,0; 2 2.75,0
TC26H = drill 0.813: 1 -1.27,0; 2 1.27,0
R0603 = smd 1 x 1.1: 1 -0.85,0; 2 0.85,0
CTS742C083-RES = smd 0.9 x 0.5: 1 -0.8,1.2; 2 0.8,1.2; 3 -0.8,0.4; 4 0.8,0.4; 5 -0.8,-0.4; 6 0.8,-0.4; 7 -0.8,-1.2; 8 0.8,-1.2
1X03 = drill 1.016 square: 1 -2.54,0 | drill 1.016 octagon: 2 0,0; 3 2.54,0
EVQPSD02K = smd 1 x 1.8: A -1.7,2.15; A' -1.7,-2.15; B 1.7,2.15; B' 1.7,-2.15 | hole 0.9: -1.5,0; 1.5,0
SOT223 = smd 1.219 x 2.235: 1 -2.311,-3.099; 2 0,-3.099; 3 2.311,-3.099 | smd 3.6 x 2.2: 4 0,3.099
QFN64 = smd 0.7 x 0.25: 1 -4.4,3.75; 2 -4.4,3.25; 3 -4.4,2.75; 4 -4.4,2.25; 5 -4.4,1.75; 6 -4.4,1.25; 7 -4.4,0.75; 8 -4.4,0.25; 9 -4.4,-0.25; 10 -4.4,-0.75; 11 -4.4,-1.25; 12 -4.4,-1.75; 13 -4.4,-2.25; 14 -4.4,-2.75; 15 -4.4,-3.25; 16 -4.4,-3.75; 33 4.4,-3.75; 34 4.4,-3.25; 35 4.4,-2.75; 36 4.4,-2.25; 37 4.4,-1.75; 38 4.4,-1.25; 39 4.4,-0.75; 40 4.4,-0.25; 41 4.4,0.25; 42 4.4,0.75; 43 4.4,1.25; 44 4.4,1.75; 45 4.4,2.25; 46 4.4,2.75; 47 4.4,3.25; 48 4.4,3.75 | smd 0.25 x 0.7: 17 -3.75,-4.4; 18 -3.25,-4.4; 19 -2.75,-4.4; 20 -2.25,-4.4; 21 -1.75,-4.4; 22 -1.25,-4.4; 23 -0.75,-4.4; 24 -0.25,-4.4; 25 0.25,-4.4; 26 0.75,-4.4; 27 1.25,-4.4; 28 1.75,-4.4; 29 2.25,-4.4; 30 2.75,-4.4; 31 3.25,-4.4; 32 3.75,-4.4; 49 3.75,4.4; 50 3.25,4.4; 51 2.75,4.4; 52 2.25,4.4; 53 1.75,4.4; 54 1.25,4.4; 55 0.75,4.4; 56 0.25,4.4; 57 -0.25,4.4; 58 -0.75,4.4; 59 -1.25,4.4; 60 -1.75,4.4; 61 -2.25,4.4; 62 -2.75,4.4; 63 -3.25,4.4; 64 -3.75,4.4 | smd 5.65 x 4.75: PAD 0,0
SSOP20 = smd 0.317 x 1.27: 1 -2.857,-3.048; 2 -2.223,-3.048; 3 -1.587,-3.048; 4 -0.953,-3.048; 5 -0.318,-3.048; 6 0.318,-3.048; 7 0.953,-3.048; 8 1.587,-3.048; 9 2.223,-3.048; 10 2.857,-3.048; 11 2.857,3.048; 12 2.224,3.048; 13 1.587,3.048; 14 0.953,3.048; 15 0.318,3.048; 16 -0.318,3.048; 17 -0.953,3.048; 18 -1.587,3.048; 19 -2.223,3.048; 20 -2.857,3.048
SOT23-5 = smd 0.69 x 0.99: 1 -0.95,-1.29; 2 0,-1.29; 3 0.95,-1.29; 4 0.95,1.3; 5 -0.95,1.3
SOT23-5' = smd 0.55 x 1.2: 1 -0.95,-1.3; 2 0,-1.3; 3 0.95,-1.3; 4 0.95,1.3; 5 -0.95,1.3
1X02 = drill 1.016 square: 1 -1.27,0 | drill 1.016 octagon: 2 1.27,0
USB-MB-S = smd 2.5 x 0.5: D+ 2.5,0; D- 2.5,0.8; GND 2.5,-1.6; ID 2.5,-0.8; VBUS 2.5,1.6 | smd 2.5 x 2: GND@1 -3,4.5; GND@2 2.5,4.5; GND@3 -3,-4.5; GND@4 2.5,-4.4 | drill 0.9: P$5 0,2.2; P$6 0,-2.2
PJ002A-SMT = smd 2.8 x 2.4: 1A 5,5.7; 1B 11.1,5.7; 2 5,-5.7; 3 11.1,-5.7 | hole 1.6: 5,0 | hole 1.8: 9.5,0

### Placement (x,y rotation side)
ANALOG  57.15,2.54 0 top
ANT1  50.16,21.59 90 top
ANT2  50.8,16.51 0 top
AUX  57.78,22.23 270 top
B1  45.72,19.68 270 top
BAT-TEST  5.08,24.13 270 bottom
C1  31.11,27.94 270 top
C2  31.11,31.75 90 top
C3  8.89,30.48 90 top
C4  20.32,21.59 90 top
C5  20.32,26.67 270 top
C6  21.59,9.53 0 top
C7  61.59,17.14 90 top
C8  63.5,17.14 90 top
C9  37.47,24.13 270 top
C10  45.09,22.73 90 top
C11  46.35,22.73 90 top
C12  38.61,31.11 180 top
C13  42.55,37.34 90 top
C14  52.7,28.57 0 top
C15  38.61,27.3 0 top
C16  38.61,28.57 0 top
C17  11.43,39.37 270 top
C18  10.79,45.72 0 top
C19  10.16,39.37 270 top
C20  10.79,34.29 0 top
CHG  2.54,29.21 90 top
CLKI  52.7,34.92 0 top
D1  14.61,9.53 90 top
D2  57.15,43.18 90 top
D3  53.34,11.43 270 top
D4  62.23,41.27 270 top
D5  52.07,43.18 90 top
D6  46.99,43.18 270 top
D7  38.73,11.43 270 top
D8  43.81,11.43 90 top
D9  48.9,11.43 90 top
D10  36.83,43.18 90 top
D11  41.91,43.18 90 top
D11-J  31.11,44.45 180 bottom
D12  33.02,38.73 270 top
D13  28.57,38.73 270 top
D14  13.34,17.14 180 top
D15  25.4,29.84 90 top
DIGITAL0  54.61,50.8 180 top
DIGITAL1  30.23,50.8 180 top
F2  4.45,34.92 180 top
GND  26.04,45.72 0 bottom
ICSP  64.91,27.89 270 top
JP1  3.17,20.32 90 top
L  25.4,40.01 180 top
L1  10.79,36.2 0 top
LOGO1  33.66,22.23 0 bottom
POWER  36.83,2.54 0 top
PWR  32.38,11.43 270 top
PWR-LED  26.67,10.79 180 top
Q1  34.29,29.84 90 top
Q2  66.04,22.23 180 top
R1  37.47,20.95 270 top
R2  2.54,31.11 0 top
R3  2.54,27.3 180 top
R4  10.79,43.18 0 top
R5  10.79,44.45 0 top
R6  29.21,11.43 0 top
R7  24.13,43.18 270 top
R8  56.52,38.1 270 top
R9  58.42,38.1 270 top
R10  25.4,24.77 0 top
R11  25.4,22.86 180 top
R12  48.26,6.99 90 top
R13  39.37,46.99 270 top
R14  49.53,46.99 270 top
R15  59.69,46.99 270 top
R16  30.48,42.55 270 top
R17  60.33,9.53 90 top
RFRX  56.52,34.92 0 top
RFTX  58.42,34.92 0 top
RX  22.86,40.01 0 top
SPI  31.5,47.62 0 top
SW1  22.1,4.45 270 top
TX  24.13,40.01 0 top
U1  13.97,25.4 90 top
U2  23.5,15.24 270 top
U3  45.72,29.84 90 top
U4  16.51,41.27 90 top
U6  34.92,20.95 180 top
U7  MCP73831  [SOT23-5']  5.71,27.94 0 top
U$3  [FIDUCIAL_G10]  28.57,35.05 0 top
U$4  [LOGO-SM]  23.62,19.43 0 bottom
U$5  [FIDUCIAL_G10]  62.61,12.83 0 top
UART0  17.78,34.29 180 top
USB  5.08,43.81 0 top
USB+  7.62,40.64 0 bottom
USB-  7.62,43.18 0 bottom
USB-5V  7.62,45.72 0 bottom
X1  -3.17,7.62 0 top

### Tracks (layer width: path | path; a pad name or v marks a point on that pad's centre or on a via)
+3V3  (via drill 0.33, 0.61)
  Top 0.178: D13.5 v28.57,38.73 D13.2 | D12.5 v33.02,38.73 D12.2 | D10.2 v36.83,43.18 D10.5 | D7.5 v38.73,11.43 D7.2 | D8.2 v43.81,11.43 D8.5 | D9.2 v48.9,11.43 D9.5 | D11.5 v41.91,43.18 | D6.5 v46.99,43.18 D6.2 | D5.2 v52.07,43.18 D5.5 | D2.2 v57.15,43.18 D2.5 | D4.5 v62.23,41.27 D4.2 | D3.5 v53.34,11.43 D3.2 | C12.1 39.48,31.09 U3.54 42.14,31.09 v42.42,31.37 | U3.59 42.27,28.59 v42.42,28.45 | v44.2,33.27 43.97,33.5 U3.44 43.97,35.06 C13.1 | U3.23 49.14,29.09 49.02,28.98 v49.02,28.57 | U3.34 48.97,33.22 v48.9,33.15 | v35.94,18.03 35.88,18.1 U6.5 37.02,19.66 R1.2 | RX.A TX.A 24.25,39.26 v25.4,38.1
  Top 0.61: U2.3 20.4,11.51 v20.32,11.43 20.32,9.65 C6.1
  Bottom 0.61: v20.32,11.43 21.59,11.43
  pour Route15: 0,53.34 68.58,53.34 68.58,0 0,0
+5V  (via drill 0.41, 0.61)
  Top 0.178: 14.61,27.3 14.61,29.21 13.34,30.48 6.99,30.48 6.67,30.16 U7.4
  Top 0.406: U1.3 15.01,27.71 14.61,27.3 14.61,18.07 D14.C | v38.1,8.19 37.78,7.87 27.69,7.87 24.77,10.79 | 20.45,27.94 24.77,27.94 25.7,27.01 D15.C | v23.5,13.97 23.5,12.06 24.77,10.79 | PWR-LED.2 24.77,10.79
  Top 0.61: 17.32,27.96 U1.3 19.96,27.71 C5.1 20.45,27.94 | D14.C 15.54,14.95 v15.88,14.61 | v23.5,13.97 23.5,16.51 22.45,17.55 U2.1
  Bottom 0.406: v38.1,8.19 POWER.5
  Bottom 0.61: v15.88,14.61 22.86,14.61 v23.5,13.97
AREF  (via drill 0.33)
  Top 0.305: U3.62 39.67,27.09 C15.2 39.46,26.76 v38.73,26.04
  Bottom 0.305: v38.73,26.04 38.61,25.91 24.89,25.91 23.88,26.92 DIGITAL1.8
BATMON  (via drill 0.33, 0.38)
  Top 0.178: U3.5 43.97,24.41 43.05,23.5 43.05,22.1 v43.18,21.97 | R10.2 R11.1 v28.57,22.86
  Route2 0.178: v28.57,22.86 42.29,22.86 v43.18,21.97
  Bottom 0.178: v43.18,21.97 44.01,21.97 46.55,24.51 52.96,24.51 55.12,22.35 55.12,17.89 AUX.13
D+  (via drill 0.33)
  Top 0.178: C18.1 R5.1 9.53,44.45 8.89,43.81 USB.D+ 6.1,43.81 5.46,43.18 v5.46,42.93
  Bottom 0.178: USB+.TP 7.62,40.77 v5.46,42.93
D-  (via drill 0.33)
  Top 0.178: USB.D- 5.88,44.62 v5.08,43.94 | R4.1 9.95,42.33 v9.53,41.91 10.16,41.27 C19.1
  Bottom 0.178: v5.08,43.94 7.49,43.94 7.94,43.5 | 7.94,43.5 v9.53,41.91 | USB-.TP 7.94,43.5
DTR
  Top 0.178: U4.1 19.37,38.42 17.78,36.83 17.78,33.4 18.16,33.02 22.23,33.02 22.86,33.66 28.57,33.66 28.96,33.27 28.96,26.29 30.27,24.98 C9.1
GND  (via drill 0.33)
  Top 0.305: U3.10 46.47,24.9 46.61,24.77 46.48,24.77 46.48,26.16 46.99,26.16 46.99,24.77
  Bottom 0.254: GND.TP 26.04,50.42 DIGITAL1.7
  other vias: 52.07,44.45 57.15,44.45 62.23,42.55 46.99,44.45 41.91,44.45 36.83,44.45 33.02,40.01 28.57,40.01 38.73,10.16 43.81,10.16 48.9,10.29 38.73,12.7 43.81,12.7 48.9,12.7 53.34,12.7 53.34,10.29 50.93,35.31 42.55,29.72 49.02,30.35 45.72,33.27 45.72,26.42 54.36,27.18 49.02,27.3 52.45,23.75 52.45,22.99 52.45,22.23 52.45,21.46 52.45,20.7 52.45,19.94 52.45,19.18 51.69,19.18 50.93,19.3 48.9,19.18 47.75,20.19 47.75,20.95 47.75,21.72 47.75,22.48 47.75,23.24 48.64,23.88 48.39,18.54 48.26,17.78 48.39,17.02 49.02,16.64 48.51,16 48.26,15.24 48.39,14.48 49.02,14.1 49.78,13.97 50.42,14.35 50.67,15.11 51.18,14.35 51.94,13.97 52.7,14.1 53.21,14.73 53.34,15.49 52.96,16.26 52.2,16.51 53.21,17.02 53.34,17.78 53.21,18.54 53.21,19.3 47.62,18.29 46.86,18.29 46.1,18.29 45.34,18.29 44.58,18.29 43.81,18.54 43.69,19.3 43.69,20.07 43.81,20.83 36.45,31.88 36.45,27.94 46.99,42.16 41.91,42.16 52.07,42.16 57.15,42.16 55.24,38.99 43.18,33.27 37.97,41.27 28.57,37.47 33.02,37.47 32.38,28.57 32.38,29.84 32.38,31.11 29.84,31.11 29.84,29.84 29.84,28.57 27.94,27.94 27.94,24.13 22.86,11.43 21.59,10.16 21.59,8.89 24.77,9.53 28.57,15.24 28.57,16.51 28.57,13.97 18.8,24.13 18.8,25.4 18.8,22.86 54.48,35.05
  pour Top (rank 2): 0,53.34 68.58,53.34 68.58,0 0,0
  pour Route2: 0,53.34 68.58,53.34 68.58,0 0,0
  pour Bottom (rank 3): 0,53.34 68.58,53.34 68.58,0 0,0
MISO
  Top 0.178: R16.2 33.19,41.74 34.22,40.71 D12.1 46.04,39.69 46.67,39.05 | ICSP.1 62.91,30.43 61.59,31.75 61.59,38.1 59.69,40.01 47.62,40.01 46.67,39.05 | 46.67,39.05 46.47,38.85 U3.39
MOSI  (via drill 0.33)
  Top 0.178: R16.8 v27.94,41.74 27.14,41.74 26.67,41.27 26.67,38.1 26.98,37.78 D13.4 | ICSP.4 66.09,27.89 64.77,29.21 62.87,29.21 60.96,31.11 60.96,36.2 59.05,38.1 47.62,38.1 | U3.38 46.97,37.45 47.62,38.1 | 47.62,38.1 v47.62,38.73 | v45.72,40.64 v35.56,40.64
  Bottom 0.178: v35.56,40.64 29.05,40.64 v27.94,41.74 | v45.72,40.64 v47.62,38.73
MOSI-PIN  (via drill 0.33)
  Top 0.178: R16.7 29.05,43.34 v27.94,44.45
  Route2 0.178: SPI.3 34.04,44.83 33.66,44.45 v27.94,44.45
  Bottom 0.178: v27.94,44.45 D11-J.1
N$1
  Top 0.178: R9.2 RFTX.C
N$2
  Top 0.178: R7.2 25.33,40.83 L.A
N$3
  Top 0.406: R6.2 PWR.A
N$4
  Top 0.305: C10.1 45.09,20.6 B1.4
N$5
  Top 0.178: R15.5 59.29,49.93 DIGITAL0.3
N$6
  Top 0.178: U3.57 36.79,29.59 Q1.1 C1.2
N$7
  Top 0.178: U3.56 36.79,30.09 Q1.2 C2.2
N$8
  Top 0.406: PWR-LED.1 27.73,10.79 R6.1
N$9
  Top 0.305: C11.1 46.35,20.6 B1.3
N$10
  Top 0.178: DIGITAL1.5 SPI.2 31.68,47.44 R16.1
N$11
  Top 0.178: R14.1 50.73,48.19 DIGITAL0.5
N$12
  Top 0.178: R14.5 49.13,49.93 DIGITAL0.7
N$13
  Top 0.178: R14.3 49.93,49.93 DIGITAL0.6
N$14
  Top 0.178: DIGITAL0.4 55.88,50.4 R15.7
N$15
  Top 0.178: DIGITAL0.8 45.72,50.4 R14.7
N$16  (via drill 0.33)
  Top 0.178: D3.1 v57.15,12.38 60.71,12.38 61.52,11.56 R17.8 | U3.25 51.19,30.09 v51.44,29.84
  Route15 0.178: v51.44,29.84 51.44,27.94 53.98,25.4 53.98,15.55 v57.15,12.38
N$17  (via drill 0.33)
  Top 0.178: D3.4 52.14,10.09 52.7,9.53 54.99,9.53 55.88,10.41 v55.88,11.43 | v60.71,11.43 60.71,10.34 R17.6 | U3.26 51.95,30.59 v52.7,29.84
  Route15 0.178: v52.7,29.84 52.7,29.21 52.07,28.57 52.07,27.94 54.61,25.4 54.61,16.51 58.42,12.7 58.42,12.06 57.78,11.43 v55.88,11.43
  Bottom 0.178: v55.88,11.43 57.78,11.43 58.42,10.79 60.07,10.79 v60.71,11.43
N$18
  Top 0.305: B1.1 47.61,19.04 ANT1.A 49.2,20.02 50.8,18.41 ANT2.C
N$19  (via drill 0.33)
  Top 0.178: R16.4 30.88,38.34 31.43,37.78 D12.4 31.82,36.38 v32,36.2 | U3.41 45.47,36.83 v44.58,37.72
  Bottom 0.178: v44.58,37.72 42.93,37.72 41.91,38.73 37.47,38.73 34.92,36.2 v32,36.2
N$20
  Top 0.178: R8.2 RFRX.C
N$21  (via drill 0.33)
  Top 0.178: R15.6 59.29,44.69 | D2.4 58.73,44.13 v59.31,44.7 59.29,44.69 | 59.24,44.64 59.29,44.69 | v36.83,34.29 38.86,32.26 40.51,32.26 40.68,32.09 U3.52
  Bottom 0.178: v36.83,34.29 37.85,33.27 42.16,33.27 43.05,32.38 46.23,32.38 54.74,40.89 58.55,40.89 59.31,41.66 v59.31,44.7
N$22  (via drill 0.33)
  Top 0.178: R15.8 55.72,46.19 55.24,45.72 v55.24,45.09 55.24,42.55 55.56,42.23 D2.1 | U3.51 39.67,32.59 v37.97,34.29
  Bottom 0.178: v37.97,34.29 38.61,33.66 41.53,33.66 41.78,33.91 47.24,33.91 52.96,39.62 52.96,42.8 v55.24,45.09
N$23
  Top 0.305: U3.8 45.47,24.09 C10.2
N$24
  Top 0.305: U3.9 45.97,24.09 C11.2
N$25
  Top 0.178: DIGITAL1.6 SPI.1 30.08,46.5 R16.5
N$26
  Top 0.178: U7.5 4.76,30.8 4.45,31.11 R2.2
N$27
  Top 0.178: U7.1 4.05,26.64 R3.1
N$28
  Top 0.178: R7.4 24.53,41.16 TX.C
N$29
  Top 0.178: CHG.C 1.79,27.41 R3.2
N$30
  Top 0.178: U4.14 12.38,42.23 11.43,41.27 C17.1 | U4.13 U4.14 | U4.14 15.56,42.23 18.1,39.69 U4.3
N$31
  Top 0.178: R7.8 22.93,40.83 RX.C
N$33  (via drill 0.33)
  Top 0.178: R13.4 39.77,42.78 40.32,42.23 D11.1 40.01,41.52 v40.01,41.27 | U3.40 45.97,37.53 44.9,38.61 v44.07,38.61
  Bottom 0.178: v44.07,38.61 42.67,38.61 v40.01,41.27
N$34
  Top 0.178: U3.33 51.52,34.24 CLKI.1
N$35
  Top 0.178: U4.12 11.96,43.5 R4.2
N$36
  Top 0.178: U4.11 11.96,44.13 R5.2
N$37  (via drill 0.33)
  Top 0.305: U4.15 14.92,41.59 v15.24,41.27 | v13.97,36.2 L1.2
  Bottom 0.305: v15.24,41.27 15.24,40.64 13.97,39.37 v13.97,36.2
N$38  (via drill 0.33)
  Top 0.178: R13.8 35.4,46.19 34.92,45.72 34.92,42.55 35.24,42.23 D10.1 36.59,41.27 v36.83,41.27 | U3.42 44.97,36.31 43.94,37.34 38.61,37.34 v37.85,38.1
  Route2 0.178: v37.85,38.1 37.85,40.26 v36.83,41.27
N$39  (via drill 0.33)
  Top 0.178: R13.6 38.97,45.07 38.54,44.64 | 38.54,44.64 D10.4 | U3.43 44.47,35.67 v44.07,36.07 | v38.99,41.27 38.99,44.2 38.54,44.64
  Route2 0.178: v44.07,36.07 43.05,36.07 39.12,40.01 39.12,41.15 v38.99,41.27
N$40  (via drill 0.33)
  Top 0.178: R14.2 52.23,46.19 v53.02,45.4 53.27,45.16 D5.4 | U3.48 41.97,34.61 41.66,34.92 40.13,34.92 v39.12,35.94
  Route15 0.178: v39.12,35.94 38.99,35.94 43.94,41.53 53.98,41.53 54.36,41.91 54.36,44.07 v53.02,45.4
N$41  (via drill 0.33)
  Top 0.178: R14.6 49.13,45.07 v49.02,44.96 D6.1 | U3.50 40.56,33.09 v39.37,34.29
  Bottom 0.178: v39.37,34.29 40.01,34.92 46.99,34.92 48.9,36.83 48.9,44.84 v49.02,44.96
N$42  (via drill 0.33)
  Top 0.178: R14.4 v49.93,42.78 50.48,42.23 D5.1 | U3.49 41.32,33.61 v40.64,34.29
  Bottom 0.178: v40.64,34.29 46.99,34.29 50.16,37.47 50.16,42.55 v49.93,42.78
N$43  (via drill 0.33)
  Top 0.178: R14.8 45.55,46.19 45.09,45.72 v45.09,45.47 45.09,42.55 45.4,42.23 D6.4 | U3.53 40.54,31.59 40.26,31.88 38.23,31.88 v35.81,34.29
  Bottom 0.178: v35.81,34.29 35.81,34.42 36.7,35.31 44.83,35.31 45.47,35.94 45.47,38.04 44.83,38.67 44.83,45.21 v45.09,45.47
N$44
  Top 0.178: R17.1 59.12,4.38 ANALOG.5
N$45
  Top 0.178: R17.3 59.92,6.12 ANALOG.6
N$47  (via drill 0.33)
  Top 0.178: v43.94,22.86 43.94,23.88 44.47,24.4 U3.6
  Bottom 0.178: AUX.11 56.7,18.23 55.63,19.3 55.63,22.61 53.34,24.89 45.97,24.89 v43.94,22.86
N$48
  Top 0.178: R12.2 39.84,7.79 37.53,10.09 D7.4 37.15,10.48 36.83,10.79 36.83,13.34 39.37,15.88 39.37,25.4 40.56,26.59 U3.63
N$49
  Top 0.178: R12.4 47.86,8.3 47.65,8.51 41.66,8.51 41.27,8.89 41.27,11.94 40.83,12.38 D7.1 39.94,25.33 40.7,26.09 U3.64
N$50
  Top 0.178: R12.6 48.66,8.49 48.26,8.89 43.18,8.89 42.62,9.46 D8.1 42.23,10.48 41.91,10.79 41.91,12.06 40.64,13.34 40.64,24.77 41.26,25.39 41.91,25.39 U3.1
N$51
  Top 0.178: R12.8 49.46,8.32 48.51,9.27 47.24,9.27 46.35,10.16 46.35,11.43 45.41,12.38 D8.4 45.02,13.4 41.27,17.14 41.27,23.5 42.47,24.69 U3.2
N$52
  Top 0.178: U3.3 42.97,24.55 41.91,23.5 41.91,17.14 46.99,12.06 46.99,10.79 47.3,10.48 D9.1 47.7,9.84 47.88,9.65 48.64,9.65 49.15,9.14 55.12,9.14 56.3,10.32 R17.2
N$53  (via drill 0.33)
  Top 0.178: U3.4 43.47,24.42 42.55,23.5 42.55,17.14 46.35,13.34 49.53,13.34 50.09,12.77 D9.4 50.09,12.63 50.8,13.34 v59.69,13.34 | R17.4 59.92,11.2 v59.69,11.43
  Bottom 0.178: v59.69,13.34 v59.69,11.43
N$54
  Top 0.178: R12.1 47.06,4.38 48.9,2.54 ANALOG.1
N$55
  Top 0.178: ANALOG.2 52.07,3.81 48.9,3.81 47.86,4.84 R12.3
N$56
  Top 0.178: R12.5 48.66,4.68 49.15,4.19 54.23,4.19 ANALOG.3
N$57
  Top 0.178: R12.7 49.46,5.02 49.91,4.57 56.39,4.57 ANALOG.4
N$60
  Top 0.178: DIGITAL1.1 41.66,50.55 39.77,48.66 R13.3
N$61
  Bottom 0.178: D11-J.2 31.11,45.09 32.77,46.74 32.77,49.53 DIGITAL1.4
N$62
  Top 0.178: U3.14 48.47,24.94 49.02,24.38 52.83,24.38 54.99,22.23 54.99,20.57 56.33,19.24 57.77,19.24 AUX.12
N$63
  Top 0.178: C14.1 51.84,28.59 U3.22 U3.21
N$64
  Top 0.178: U3.60 39.94,28.09 C16.2
N$65
  Top 0.178: DIGITAL1.2 39.12,47.94 R13.5
N$68
  Top 0.178: R15.1 60.89,48.19 DIGITAL0.1
N$69
  Top 0.178: R15.3 60.09,49.93 DIGITAL0.2
N$70
  Top 0.178: U3.15 48.97,25.07 49.28,24.77 53.09,24.77 55.37,22.48 55.37,21.64 AUX.9
N$71
  Top 0.178: U3.19 53.3,27.09 56.17,24.23 AUX.5
N$72
  Top 0.178: U3.18 52.91,26.59 56.26,23.24 57.77,23.24 AUX.8 | C7.2 61.59,18.41 62.23,19.05 64.14,19.05 64.77,19.68 Q2.2
  Bottom 0.178: AUX.8 Q2.2
N$73
  Top 0.178: U3.17 52.91,26.09 AUX.7 | C8.2 66.25,18 67.31,19.05 Q2.1
  Bottom 0.178: AUX.7 56.78,22.5 57.53,23.24 66.29,23.24 Q2.1
N$74
  Top 0.178: U3.16 52.91,25.45 55.75,22.61 55.75,21.84 56.39,21.21 57.8,21.21 AUX.10
PB0
  Top 0.178: AUX.4 58.78,26.3 57.78,27.3 57.78,33.02 57.66,33.15 57.66,34.54 57.28,34.92 55.88,34.92 54.61,36.2 48.9,36.2 47.97,35.27 U3.36
PD4
  Top 0.178: U3.29 53.69,32.09 55.24,30.54 55.24,25.77 55.8,25.21 57.85,25.21 58.78,24.27 AUX.6
PD7  (via drill 0.33)
  Top 0.178: AUX.3 56.78,26.27 55.75,27.3 55.75,30.35 | 55.75,30.35 55.88,30.48 | 55.75,30.35 55.75,30.99 v54.99,31.75 | U3.32 54.68,33.59 v54.86,33.78
  Bottom 0.178: v54.99,31.75 54.99,33.66 v54.86,33.78
PWM-10
  Top 0.178: R13.7 37.3,47.79 36.58,48.51 DIGITAL1.3
PWM-11  (via drill 0.33)
  Top 0.178: R16.3 30.88,42.78 31.11,42.55 v33.02,42.55
  Bottom 0.178: v33.02,42.55 33.02,44.07 D11-J.3
PWRIN
  Top 0.61: X1.1A X1.1B 12.71,13.32 14.61,11.43 D1.A
RESET  (via drill 0.33)
  Top 0.178: U6.2 34.92,22.86 35.34,23.28 C9.2 R1.1 37.88,21.8 38.73,20.95 38.73,20.19 v38.73,18.54 38.73,15.88 v35.56,12.7 | SW1.A' 19.99,6.14 20.83,6.99 23.41,6.99 SW1.A 29.41,6.14 POWER.3
  Route2 0.178: v35.56,12.7 35.56,5.08 POWER.3
  Bottom 0.178: ICSP.5 59.26,25.35 59.12,25.21 43.62,25.21 38.73,20.32 v38.73,18.54
RFRX
  Top 0.178: AUX.1 56.78,33.91 RFRX.A 55.44,33.09 U3.31
RFTX  (via drill 0.33)
  Top 0.178: AUX.2 v58.78,32.38 58.78,33.02 58.78,33.81 RFTX.A | U3.30 55.67,32.59 v55.88,32.38
  Bottom 0.178: v55.88,32.38 v58.78,32.38
RST  (via drill 0.33)
  Top 0.178: U3.12 47.5,25.47 47.5,26.29 v47.69,26.42 | v34.92,20.95 34.92,20.61 U6.4
  Bottom 0.178: v47.69,26.42 47.62,26.04 47.37,25.78 43.24,25.78 42.86,25.4 37.47,25.4 34.92,22.86 v34.92,20.95
RXD0  (via drill 0.38)
  Top 0.178: U3.46 42.97,34.88 42.16,35.69 41.15,35.69 39.88,36.96 34.42,36.96 32.89,35.43 30.61,35.43 29.34,36.7 21.59,36.7 20.95,36.07 20.95,34.92 20.32,34.29 UART0.1 | U4.20 16.19,38.42 v16.51,38.1
  Bottom 0.178: v16.51,38.1 16.51,36.83 UART0.1
RXD1  (via drill 0.33)
  Top 0.178: R15.2 62.4,46.19 v62.55,46.04 62.87,45.72 63.43,45.16 D4.1 | U3.27 52.73,31.09 v53.98,29.84
  Bottom 0.178: v53.98,29.84 59.69,29.84 61.59,31.75 61.59,45.09 v62.55,46.04
RXLED  (via drill 0.33)
  Top 0.178: U4.17 15.56,40.32 v16.51,39.37 | v20.83,43.18 22.13,43.18 R7.7
  Bottom 0.178: v16.51,39.37 16.51,42.55 17.14,43.18 v20.83,43.18
SCK  (via drill 0.33)
  Top 0.178: ICSP.3 62.28,27.89 60.33,29.84 60.33,34.29 59.69,34.92 57.91,34.92 57.53,35.31 v57.53,36.32 | v53.34,36.83 48.26,36.83 47.88,36.45 | U3.37 47.47,36.04 47.88,36.45 | 47.88,36.45 v47.88,37.34 | v45.59,38.86 45.21,39.24 36.7,39.24 v36.2,38.73 | v30.73,36.83 30.73,37.72 30.48,37.97 30.48,39.5 30.29,39.69 D13.1 30.08,39.99 R16.6 30.08,42.31 29.84,42.55 27.94,42.55 26.5,43.98 R7.1
  Bottom 0.178: v57.53,36.32 53.85,36.32 v53.34,36.83 | v47.88,37.34 47.12,37.34 v45.59,38.86 | v30.73,36.83 31.5,36.83 31.62,36.96 32.38,36.96 32.64,36.7 34.16,36.7 v36.2,38.73
SCL  (via drill 0.33)
  Top 0.178: R17.7 62.06,8.72 v62.87,9.53 | v22.86,48.9 20.7,48.9 DIGITAL1.10
  Bottom 0.178: 62.48,9.14 v62.87,9.53 62.23,10.16 55.88,10.16 54.99,9.27 30.73,9.27 21.72,18.29 21.72,42.16 22.1,42.55 22.1,43.69 21.72,44.07 21.72,47.75 v22.86,48.9
SDA  (via drill 0.33)
  Top 0.178: R17.5 60.73,9.12 60.33,9.53 v56.52,9.53
  Bottom 0.178: 57.4,9.53 v56.52,9.53 55.88,9.53 55.24,8.89 30.48,8.89 21.34,18.03 21.34,42.29 21.72,42.67 21.72,43.56 21.34,43.94 DIGITAL1.9
TXD0  (via drill 0.33, 0.38)
  Top 0.178: U3.47 42.47,34.87 42.04,35.31 41.02,35.31 39.75,36.58 34.54,36.58 33.02,35.05 30.48,35.05 29.21,36.32 23.11,36.32 v22.73,35.94 | U4.4 18.73,40.32 v17.78,41.27
  Route2 0.178: UART0.2 16.51,34.92 17.53,35.94 | v22.73,35.94 17.53,35.94 | v17.78,41.27 17.78,36.2 17.53,35.94
TXD1  (via drill 0.33)
  Top 0.178: R15.4 60.09,41.27 v60.09,40.88 60.64,40.33 D4.4 | U3.28 53.24,31.59 v53.98,30.86
  Bottom 0.178: v53.98,30.86 58.8,30.86 59.69,31.75 59.69,40.48 v60.09,40.88
TXLED
  Top 0.178: U4.10 20.64,44.13 21.59,45.09 24.13,45.09 24.53,44.69 R7.3
USBVCC
  Top 0.305: L1.1 9.7,34.54 C20.1 6.35,34.29 6.35,34.88 F2.1
  Top 0.406: C20.1 9.95,33.23 12.06,31.11 24.43,31.11 D15.A
VBAT  (via drill 0.38)
  Top 0.178: U7.3 v6.67,24.13 6.67,21.53 JP1.2 | U7.3 7.8,26.64 8.89,27.73 C3.1 | CHG.A 3.29,29.09 4.45,27.94 6.35,27.94 6.67,27.62 U7.3 | R10.1 v22.86,24.77
  Top 0.406: JP1.2 9.79,21.32 11.13,19.98 D14.A
  Route2 0.178: v22.86,24.77 7.3,24.77 v6.67,24.13
  Bottom 0.178: BAT-TEST.TP v6.67,24.13
VIN
  Top 0.61: POWER.8 45.72,3.81 42.55,6.99 26.29,6.99 25.27,8 16.89,8 | 16.89,8 15.88,6.99 15.24,6.99 14.61,6.35 D1.C | U1.1 17.07,21.03 17.91,20.19 | 17.91,20.19 C4.1 20.82,20.19 | 17.91,20.19 17.91,9.02 16.89,8
XUSB  (via drill 0.33)
  Top 0.305: F2.2 3.81,36.24 3.81,43.81 4.83,44.83 5.46,44.83 6.04,45.41 USB.VBUS 7.58,45.43 v9.91,47.75
  Bottom 0.305: v9.91,47.75 9.65,47.75 USB-5V.TP

### Text on the board
tNames: SCL | SDA | 10 | 9 | 8 | 7 | 6 | 5 | 4 | 3 | 2 | 1 | 0 | AREF | GND | DIGITAL | 13 | 12 | 11 | TX | RX | RX | TX | TX | RX | 1 | Zigduino r2 | ANALOG IN | IOREF | RESET | 3V3 | 5V Gnd Vin | 0 1 2 3 4 5 | CC BY-SA 3.0 | www.logos-electro.com/zigduino
bNames: MOSI | PWM | Product of Logos Electromechanical | www.logos-electro.com/zigduino | (c) 2012 CC-BY-SA-3.0 | ANALOG
Reference: C8 | R7 | R5 | R6 | R4 | C3 | C2 | R9 | R8 | R1 | R2 | C1 | C4 | C5 | X2 | C7 | C6